# EAGLE schematic CHIP_POCKET_C (EAGLE 7.6.0)

## Sheet 1 of 2
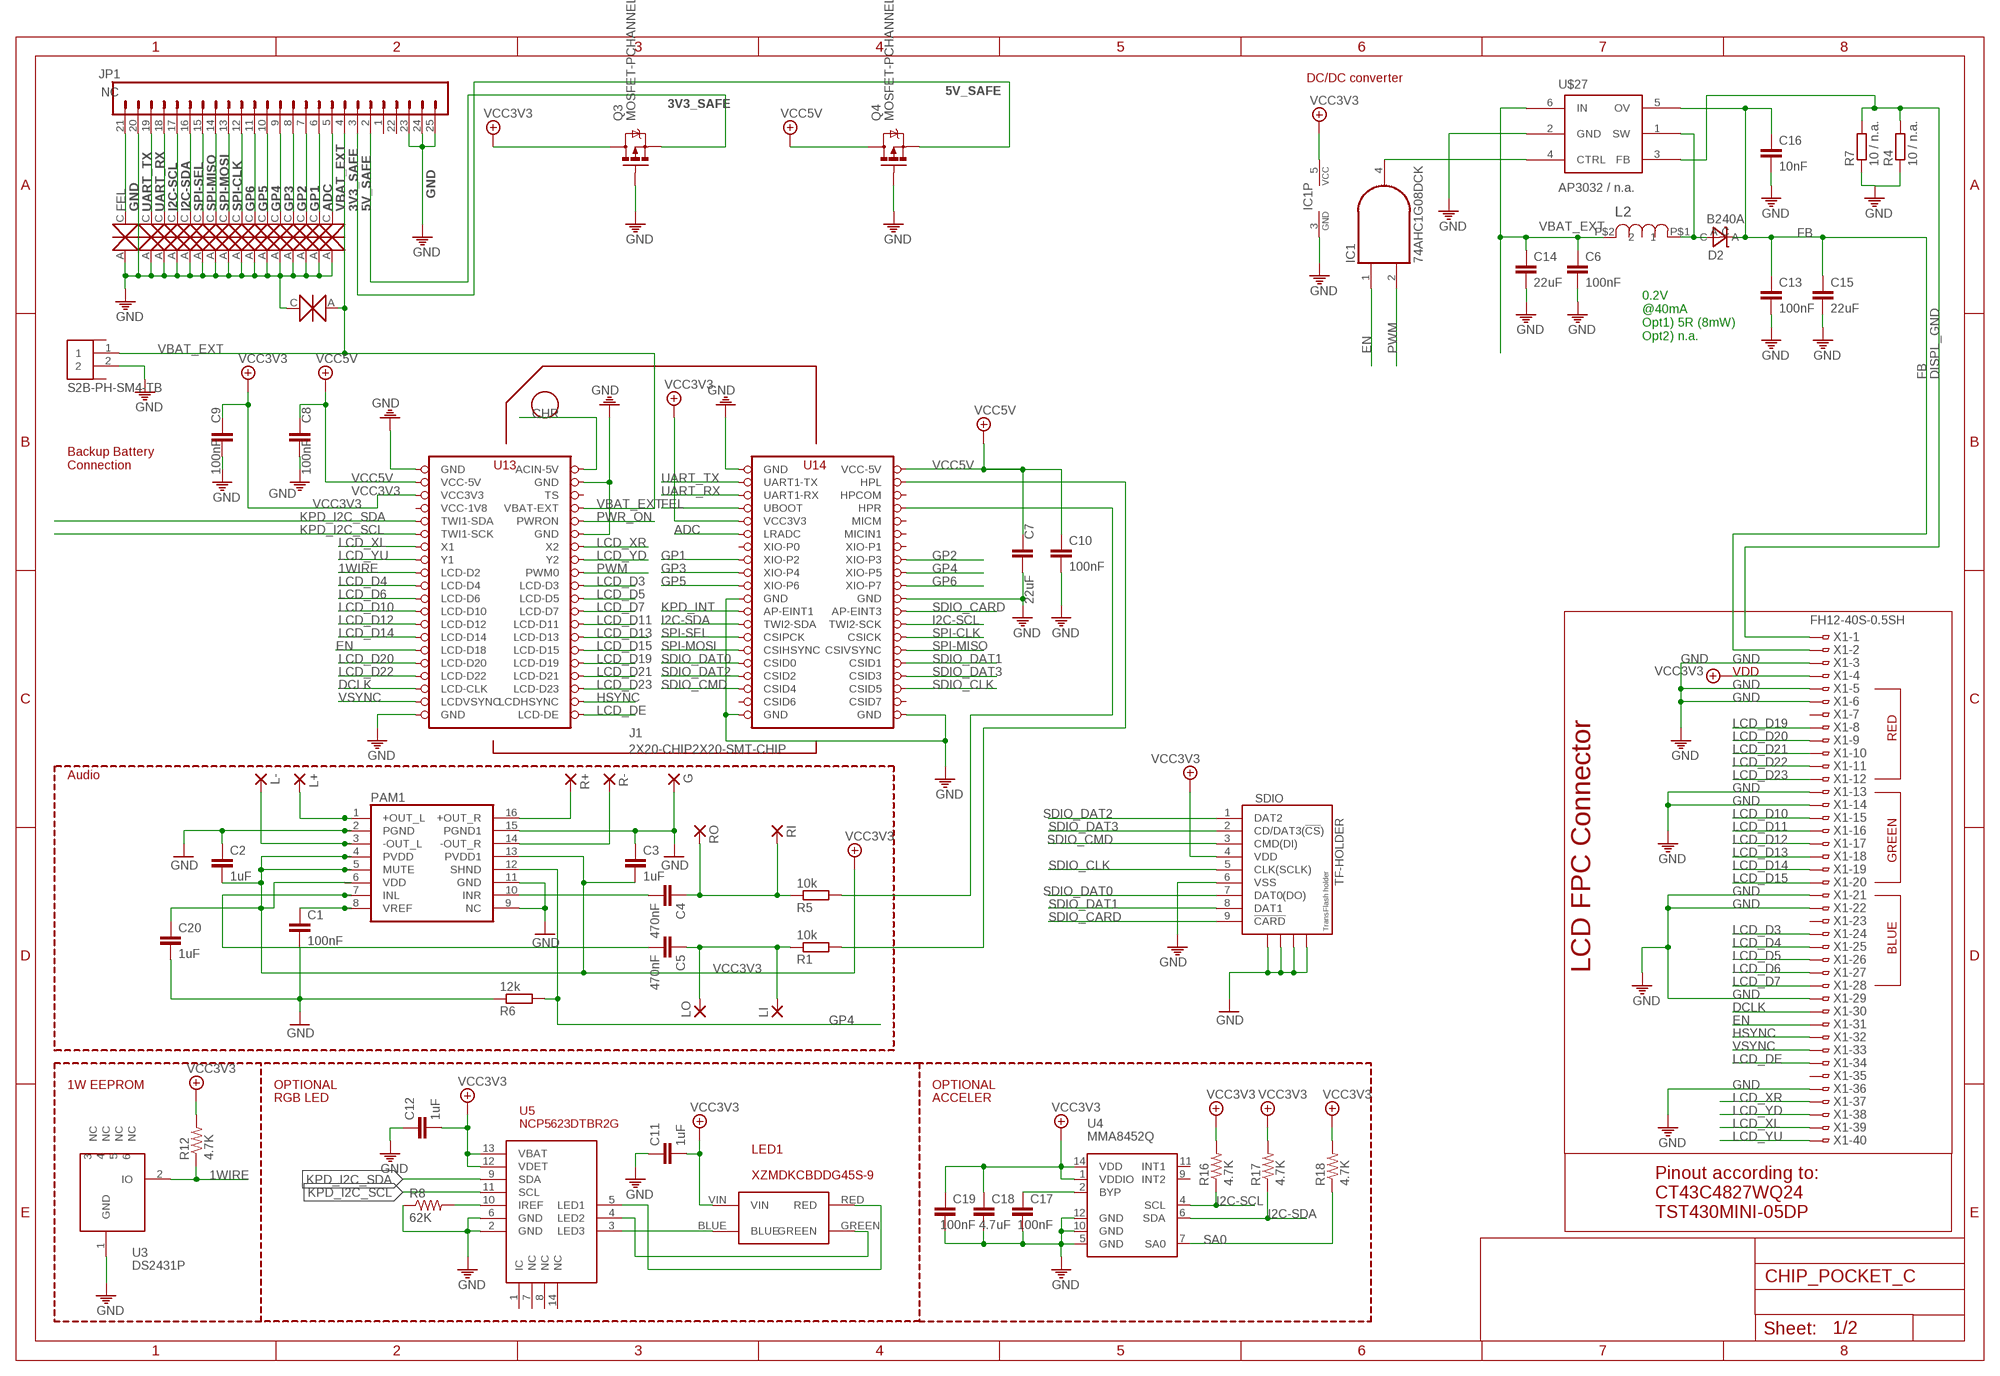
[diagram p0: schematic, sheet 1, part 1 of 2]
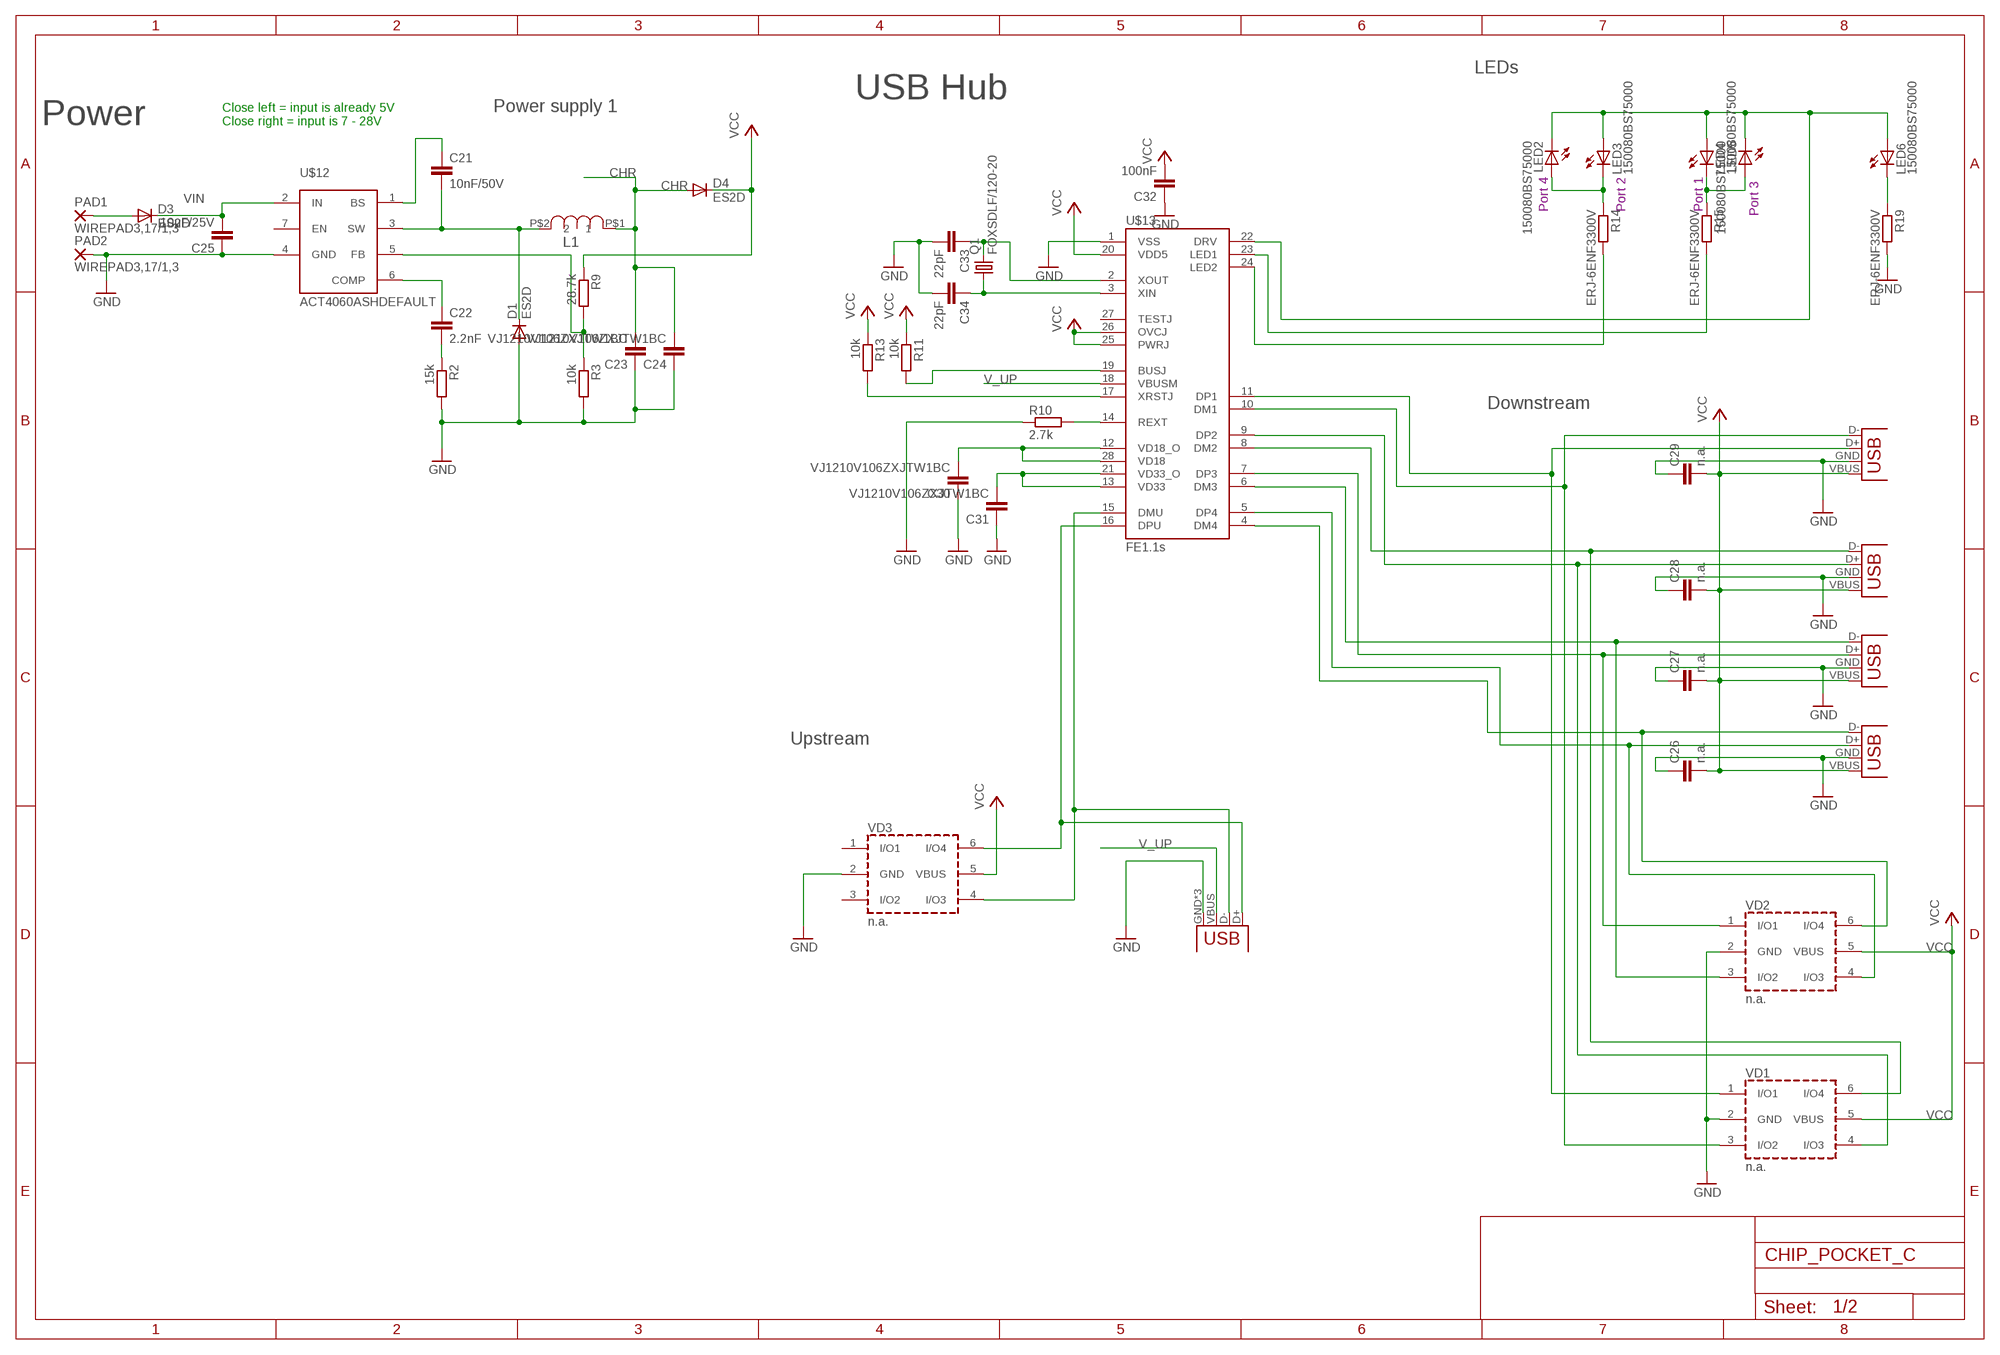
[diagram p1: schematic, sheet 1, part 2 of 2]

### Parts
C1  100nF  C-EUC0805  [C0805]
C2  1uF  C-EUC0805  [C0805]
C3  1uF  C-EUC0805  [C0805]
C4  470nF  C-EUC0805  [C0805]
C5  470nF  C-EUC0805  [C0805]
C6  100nF  C-EUC0805  [C0805]
C7  22uF  C1206_22UF_50V_10%  [C1206]
C8  100nF  C0402_100NF_50V_10%  [C0402]
C9  100nF  C0402_100NF_50V_10%  [C0402]
C10  100nF  C0402_100NF_50V_10%  [C0402]
C11  1uF  C0402_1UF_50V_10%  [C0402]
C12  1uF  C0402_1UF_50V_10%  [C0402]
C13  100nF  C-EUC0805  [C0805]
C14  22uF  C-EUC1206  [C1206]
C15  22uF  C-EUC1206  [C1206]
C16  10nF  C-EUC0805  [C0805]
C17  100nF  C0402_100NF_50V_10%  [C0402]
C18  4.7uF  C0402_100NF_50V_10%  [C0402]
C19  100nF  C0402_100NF_50V_10%  [C0402]
C20  1uF  C-EUC0805  [C0805]
C21  10nF/50V  C-EUC0805  [C0805]
C22  2.2nF  C-EUC0805  [C0805]
C23  VJ1210V106ZXJTW1BC  C-EUC1210  [C1210]
C24  VJ1210V106ZXJTW1BC  C-EUC1210  [C1210]
C25  10uF/25V  C-EUC1210  [C1210]
C26  n.a.  C-EUC1210  [C1210]
C27  n.a.  C-EUC1210  [C1210]
C28  n.a.  C-EUC1210  [C1210]
C29  n.a.  C-EUC1210  [C1210]
C30  VJ1210V106ZXJTW1BC  C-EUC1210  [C1210]
C31  VJ1210V106ZXJTW1BC  C-EUC1210  [C1210]
C32  100nF  C-EUC0805  [C0805]
C33  22pF  C-EUC0805  [C0805]
C34  22pF  C-EUC0805  [C0805]
D1  ES2D  [SMB]
D2  B240A  DIODE_SCHTKY_B240  [DO-214AC]
D3  ES2D  [SMB]
D4  ES2D  [SMB]
DATA_USB  USBUSB-MICROB-SMT-DIP  [USB-MICROB-SMT-DIP]
ESD1  ESD5Z2.5T1G  [SOD523]
ESD2  ESD5Z2.5T1G  [SOD523]
ESD3  ESD5Z2.5T1G  [SOD523]
ESD4  ESD5Z2.5T1G  [SOD523]
ESD5  ESD5Z2.5T1G  [SOD523]
ESD6  ESD5Z2.5T1G  [SOD523]
ESD7  ESD5Z2.5T1G  [SOD523]
ESD8  ESD5Z2.5T1G  [SOD523]
ESD9  ESD5Z2.5T1G  [SOD523]
ESD10  ESD5Z2.5T1G  [SOD523]
ESD11  ESD5Z2.5T1G  [SOD523]
ESD12  ESD5Z2.5T1G  [SOD523]
ESD13  ESD5Z2.5T1G  [SOD523]
ESD14  ESD5Z2.5T1G  [SOD523]
ESD15  ESD5Z2.5T1G  [SOD523]
ESD16  ESD5Z2.5T1G  [SOD523]
ESD17  ESD5Z2.5T1G  [SOD523]
G  1,6/0,8  [1,6/0,8]
IC1  74AHC1G08DCK  [SC70-5]
J1  2X20-CHIP2X20-SMT-CHIP  [2XAWHW40_G_SMD_R]
J3  S2B-PH-SM4-TB  [S2B-PH-SM4-TB]
JP1  NC  M20LOCK_LONGPADS  [1X20_LOCK_LONGPADS]
L1  SRN6045-100M  [SRN6045]
L2  SRN6045-100M  [SRN6045]
L+  1,6/0,8  [1,6/0,8]
L-  1,6/0,8  [1,6/0,8]
LED1  XZMDKCBDDG45S-9  [XZMDKCBDDG45S-9]
LED2  150080BS75000  LEDCHIP-LED0805  [CHIP-LED0805]
LED3  150080BS75000  LEDCHIP-LED0805  [CHIP-LED0805]
LED4  150080BS75000  LEDCHIP-LED0805  [CHIP-LED0805]
LED5  150080BS75000  LEDCHIP-LED0805  [CHIP-LED0805]
LED6  150080BS75000  LEDCHIP-LED0805  [CHIP-LED0805]
LI  1,6/0,8  [1,6/0,8]
LO  1,6/0,8  [1,6/0,8]
PAD1  WIREPAD3,17/1,3  [3,17/1,3]
PAD2  WIREPAD3,17/1,3  [3,17/1,3]
PAM1  PAM8403  [SOP-16]
Q1  FOXSDLF/120-20  CRYSTALSM49  [SM49]
Q3  MOSFET-PCHANNEL  [SOT23-3]
Q4  MOSFET-PCHANNEL  [SOT23-3]
R1  10k  R-EU_R0805  [R0805]
R2  15k  R-EU_R0805  [R0805]
R3  10k  R-EU_R0805  [R0805]
R4  10 / n.a.  R-EU_M0805  [M0805]
R5  10k  R-EU_R0805  [R0805]
R6  12k  R-EU_R0805  [R0805]
R7  10 / n.a.  R-EU_M0805  [M0805]
R8  62K  R0402_62K_5%  [R0402]
R9  28.7k  R-EU_R0805  [R0805]
R10  2.7k  R-EU_R0805  [R0805]
R11  10k  R-EU_R0805  [R0805]
R12  4.7K  R0402_4K7_5%  [R0402]
R13  10k  R-EU_R0805  [R0805]
R14  ERJ-6ENF3300V  R-EU_R0805  [R0805]
R15  ERJ-6ENF3300V  R-EU_R0805  [R0805]
R16  4.7K  R0402_4K7_5%  [R0402]
R17  4.7K  R0402_4K7_5%  [R0402]
R18  4.7K  R0402_4K7_5%  [R0402]
R19  ERJ-6ENF3300V  R-EU_R0805  [R0805]
R+  1,6/0,8  [1,6/0,8]
R-  1,6/0,8  [1,6/0,8]
RI  1,6/0,8  [1,6/0,8]
RO  1,6/0,8  [1,6/0,8]
SDIO  TF-HOLDER  [TF-PULL]
U3  DS2431P  [TSOC6]
U4  MMA8452Q  [QFN-16_0.5MM]
U5  NCP5623DTBR2G  [TSSOP14]
U$12  ACT4060ASHDEFAULT  [SOP-8]
U$13  FE1.1S  [FE1.1S_SSOP-28]
U$27  AP3032 / n.a.  AP3032  [SOT23-6]
VD1  n.a.  USBLC6-4SC6  [SOT-23-6L]
VD2  n.a.  USBLC6-4SC6  [SOT-23-6L]
VD3  n.a.  USBLC6-4SC6  [SOT-23-6L]
X1  FH12-40S-0.5SH  [FH12-40S-0.5SH]
X2  USB-A-HU  [USB-A-HU]
X3  USB-A-HU  [USB-A-HU]
X4  USB-A-HU  [USB-A-HU]
X5  USB-A-HU  [USB-A-HU]

### Nets
1WIRE: J1.LCD-D2 R12.1 U3.2(IO)
3V3_SAFE: JP1.2 Q3.2(S)
5V_SAFE: JP1.3 Q4.2(S)
ADC: ESD16.C J1.LRADC JP1.5
AUDIO_L: J1.HPL R1.2
AUDIO_R: J1.HPR R5.2
CHR: C23.2 C24.2 D4.A J1.CHG-IN(ACIN-5V) L1.P$1
DCLK: J1.LCD-CLK X1.30
DISPL_GND: R4.2 R7.2 U$27.3(FB) X1.1
DM1: U$13.10(DM1) VD1.3(I/O2) X5.D-(D+)
DM2: U$13.8(DM2) VD1.6(I/O4) X4.D-(D+)
DM3: U$13.6(DM3) VD2.3(I/O2) X3.D-(D+)
DM4: U$13.4(DM4) VD2.6(I/O4) X2.D-(D+)
DMU: DATA_USB.D- U$13.15(DMU) VD3.4(I/O3)
DP1: U$13.11(DP1) VD1.1(I/O1) X5.D+(D-)
DP2: U$13.9(DP2) VD1.4(I/O3) X4.D+(D-)
DP3: U$13.7(DP3) VD2.1(I/O1) X3.D+(D-)
DP4: U$13.5(DP4) VD2.4(I/O3) X2.D+(D-)
DPU: DATA_USB.D+ U$13.16(DPU) VD3.6(I/O4)
EN: IC1.1(I0) J1.LCD-D18 X1.31
FB: C13.1 C15.1 C16.1 D2.C U$27.5(OV) X1.2
FEL: ESD1.C J1.FEL(UBOOT) JP1.21
GND: C1.2 C2.1 C3.1 C6.2 C7.2 C8.2 C9.2 C10.2 C11.1 C12.1 C13.2 C14.2 C15.2 C16.2 C17.2 C18.2 C19.2 C20.2 C23.1 C24.1 C25.1 C26.1 C27.1 C28.1 C29.1 C30.1 C31.1 C32.1 C33.2 C34.2 D1.A DATA_USB.GND DATA_USB.MT1(GND) DATA_USB.MT2(GND) ESD1.A ESD2.A ESD3.A ESD4.A ESD5.A ESD6.A ESD7.A ESD8.A ESD9.A ESD10.A ESD11.A ESD12.A ESD13.A ESD14.A ESD15.A ESD16.A ESD17.C G.1(P) IC1.3(GND) J1.GND@1(GND) J1.GND@2(GND) J1.GND@3(GND) J1.GND@4(GND) J1.GND@5(GND) J1.GND@6(GND) J1.GND@7(GND) J1.GND@8(GND) J1.GND@10(GND) J3.2 JP1.20 JP1.23 JP1.24 JP1.25 PAD2.1(P) PAM1.2(PGND) PAM1.9(NC) PAM1.11(GND) PAM1.15(PGND1) Q3.1(G) Q4.1(G) R3.2 R4.1 R6.1 R7.1 R8.1 R10.1 R19.2 SDIO.6(VSS) SDIO.S1 SDIO.S2 SDIO.S3 SDIO.S4 U3.1(GND) U4.5(GND) U4.10(GND) U4.12(GND) U5.2(GND) U5.6(GND) U$12.4(GND) U$13.1(VSS) U$27.2(GND) VD1.2(GND) VD2.2(GND) VD3.2(GND) X1.3 X1.5 X1.6 X1.13 X1.14 X1.21 X1.22 X1.29 X1.36 X2.GND(VBUS) X3.GND(VBUS) X4.GND(VBUS) X5.GND(VBUS)
GP1: ESD15.C J1.XIO-P2 JP1.6
GP2: ESD14.C J1.XIO-P3 JP1.7
GP3: ESD13.C J1.XIO-P4 JP1.8
GP4: ESD12.C J1.XIO-P5 JP1.9 PAM1.12(SHND) R6.2
GP5: ESD11.C J1.XIO-P6 JP1.10
GP6: ESD10.C J1.XIO-P7 JP1.11
HSYNC: J1.LCD-HSYNC(LCDHSYNC) X1.32
I2C-SCL: ESD4.C J1.TWI2-SCK JP1.17 R16.1 U4.4(SCL)
I2C-SDA: ESD5.C J1.TWI2-SDA JP1.16 R17.1 U4.6(SDA)
INL: C5.2 PAM1.7(INL)
INR: C4.2 PAM1.10(INR)
KPD_I2C_SCL: J1.TWI1-SCK U5.11(SCL)
KPD_I2C_SDA: J1.TWI1-SDA U5.9(SDA)
KPD_INT: J1.AP-EINT1
L+OUT: L+.1(P) PAM1.1(+OUT_L)
L-OUT: L-.1(P) PAM1.3(-OUT_L)
LCD_D3: J1.LCD-D3 X1.24
LCD_D4: J1.LCD-D4 X1.25
LCD_D5: J1.LCD-D5 X1.26
LCD_D6: J1.LCD-D6 X1.27
LCD_D7: J1.LCD-D7 X1.28
LCD_D10: J1.LCD-D10 X1.15
LCD_D11: J1.LCD-D11 X1.16
LCD_D12: J1.LCD-D12 X1.17
LCD_D13: J1.LCD-D13 X1.18
LCD_D14: J1.LCD-D14 X1.19
LCD_D15: J1.LCD-D15 X1.20
LCD_D19: J1.LCD-D19 X1.8
LCD_D20: J1.LCD-D20 X1.9
LCD_D21: J1.LCD-D21 X1.10
LCD_D22: J1.LCD-D22 X1.11
LCD_D23: J1.LCD-D23 X1.12
LCD_DE: J1.LCD-DE X1.34
LCD_XL: J1.X1 X1.39
LCD_XR: J1.X2 X1.37
LCD_YD: J1.Y2 X1.38
LCD_YU: J1.Y1 X1.40
N$48: C17.1 U4.2(BYP)
N$50: LED1.GREEN U5.4(LED2)
N$51: LED1.RED U5.5(LED1)
N$53: R8.2 U5.10(IREF)
N$60: IC1.4(O) U$27.4(CTRL)
N$61: C1.1 PAM1.8(VREF)
N$62: C5.1 LI.1(P) LO.1(P) R1.1
N$63: C4.1 R5.1 RI.1(P) RO.1(P)
N$64: D3.A PAD1.1(P)
N$65: C21.2 D1.C L1.P$2 U$12.3(SW)
N$66: C21.1 U$12.1(BS)
N$67: C22.2 R2.1
N$68: C22.1 U$12.6(COMP)
N$69: R3.1 R9.2 U$12.5(FB)
N$70: C31.2 U$13.13(VD33) U$13.21(VD33_O)
N$71: C30.2 U$13.12(VD18_O) U$13.28(VD18)
N$72: R10.2 U$13.14(REXT)
N$73: R13.2 U$13.17(XRSTJ)
N$74: R11.2 U$13.19(BUSJ)
N$75: C33.1 Q1.2 U$13.2(XOUT)
N$76: C34.1 Q1.1 U$13.3(XIN)
N$77: LED6.C R19.1
N$78: LED4.C LED5.A R15.1
N$79: LED2.A LED3.C R14.1
N$80: LED2.C LED3.A LED4.A LED5.C LED6.A U$13.22(DRV)
N$81: R14.2 U$13.24(LED2)
N$82: R15.2 U$13.23(LED1)
N$555: LED1.BLUE U5.3(LED3)
PWM: IC1.2(I1) J1.PWM0
PWR_ON: J1.PWRON
R+OUT: PAM1.16(+OUT_R) R+.1(P)
R-OUT: PAM1.14(-OUT_R) R-.1(P)
SA0: R18.1 U4.7(SA0)
SDIO_CARD: J1.AP-EINT3 SDIO.9(!CARD)
SDIO_CLK: J1.CSID5 SDIO.5(CLK(SCLK))
SDIO_CMD: J1.CISD4(CSID4) SDIO.3(CMD(DI))
SDIO_DAT0: J1.CSID0 SDIO.7(DAT0(DO))
SDIO_DAT1: J1.CSID1 SDIO.8(DAT1)
SDIO_DAT2: J1.CSID2 SDIO.1(DAT2)
SDIO_DAT3: J1.CSID3 SDIO.2(CD/DAT3(!CS!))
SPI-CLK: ESD9.C J1.CSICK JP1.12
SPI-MISO: ESD7.C J1.CSIVSYNC JP1.14
SPI-MOSI: ESD8.C J1.CSIHYSYNC(CSIHSYNC) JP1.13
SPI-SEL: ESD6.C J1.CSPICK(CSIPCK) JP1.15
UART_RX: ESD3.C J1.UART1-RX JP1.18
UART_TX: ESD2.C J1.UART1-TX JP1.19
V_UP: DATA_USB.VBUS U$13.18(VBUSM)
VBAT_EXT: C6.1 C14.1 ESD17.A J1.BAT(VBAT-EXT) J3.1 JP1.4 L2.P$2 U$27.6(IN)
VCC: C26.2 C27.2 C28.2 C29.2 C32.2 D4.C R9.1 R11.1 R13.1 U$13.20(VDD5) U$13.25(PWRJ) U$13.26(OVCJ) VD1.5(VBUS) VD2.5(VBUS) VD3.5(VBUS) X2.VBUS(GND) X3.VBUS(GND) X4.VBUS(GND) X5.VBUS(GND)
VCC3V3: C2.2 C3.2 C9.1 C11.2 C12.2 C18.1 C19.1 C20.1 IC1.5(VCC) J1.VCC3V3@1(VCC3V3) J1.VCC3V3@2(VCC3V3) LED1.VIN PAM1.4(PVDD) PAM1.5(MUTE) PAM1.6(VDD) PAM1.13(PVDD1) Q3.3(D) R12.2 R16.2 R17.2 R18.2 SDIO.4(VDD) U4.1(VDDIO) U4.14(VDD) U5.12(VDET) U5.13(VBAT) X1.4
VCC5V: C7.1 C8.1 C10.1 J1.VCC-5V@1(VCC-5V) J1.VCC-5V@2(VCC-5V) Q4.3(D)
VIN: C25.2 D3.C U$12.2(IN)
VREG_OUTPUT1: D2.A L2.P$1 U$27.1(SW)
VSYNC: J1.LCD-VSYNC(LCDVSYNC) X1.33
Unconnected: J1.CSID6 J1.CSID7 J1.HPCOM J1.MICIN1 J1.MICM J1.TS J1.XIO-P0 J1.XIO-P1 J3.MNT1 J3.MNT2 JP1.1 JP1.22 R2.2 U3.3(NC) U3.4(NC) U3.5(NC) U3.6(NC) U4.9(INT2) U4.11(INT1) U5.1(IC) U5.7(NC) U5.8(NC) U5.14(NC) U$12.7(EN) U$13.27(TESTJ) VD3.1(I/O1) VD3.3(I/O2) X1.7 X1.23 X1.35

### Notes on the sheet
- DC/DC converter
- LEDs
- USB Hub
- Power supply 1
- Power
- Close left = input is already 5V
  Close right = input is 7 - 28V
- Port 4 | Port 2 | Port 1
- Port 3
- 0.2V
  @40mA
  Opt1) 5R (8mW)
  Opt2) n.a.
- <- cut here
- Downstream
- Backup Battery
  Connection
- VDD
- RED
- Upstream
- Audio
- GREEN
- cut here
- BLUE
- cut here
- LCD FPC Connector
- 1W EEPROM | OPTIONAL | OPTIONAL
- <- cut here
- RGB LED | ACCELER
- Pinout according to:
  CT43C4827WQ24
  TST430MINI-05DP

## Sheet 2 of 2

## Power pins joined to a net without a drawn wire
VCC-1V8: J1.VCC1V8(VCC-1V8)

## Library data of the parts
C1-C6 C13-C16 C20-C34 = rcl:C-EU: CAPACITOR, European symbol
C7 = Keyboard v0_5:C1206_22UF_50V_10%; DESCRIPTION: CAP ceramic smd 20% 35V 1206; FOOTPRINT: C1206; LINK: http://www.digikey.com/product-detail/en/C3216X5R1V226M160AC/445-8045-1-ND/2792165; MFG: DIGIKEY; MFG_PN: 445-8045-1-ND; PART_TYPE: C1206; PRICE: 0.01; TOLLERANCE: 20%; VENDOR: TDK; VENDOR_PART_NUMBER: C3216X5R1V226M160AC
C8-C10 = Keyboard v0_5:C0402_100NF_50V_10%; DESCRIPTION: CAP CER SMD 100nF 25V 10% 0402; FOOTPRINT: C0402; LINK: http://www.digikey.co.il/product-detail/en/C1005X5R1E104K050BC/445-4964-1-ND/2093578; MFG: DIGIIKEY; MFG_PN: 445-4964-1-ND; PART_TYPE: C0402; PRICE: 0.01; TOLLERANCE: 10%; VENDOR: TDK; VENDOR_PART_NUMBER: C1005X5R1E104K050BC
C11 C12 = Keyboard_v0_7:C0402_1UF_50V_10%; DESCRIPTION: CAP CER SMD 100nF 25V 10% 0402; FOOTPRINT: C0402; LINK: http://www.digikey.co.il/product-detail/en/C1005X5R1E104K050BC/445-4964-1-ND/2093578; MFG: DIGIIKEY; MFG_PN: 445-4964-1-ND; PART_TYPE: C0402; PRICE: 0.01; TOLLERANCE: 10%; VALUE: 100nF; VENDOR: TDK; VENDOR_PART_NUMBER: C1005X5R1E104K050BC
C17 C19 = PocketCHIP-Components-v0.71:C0402_100NF_50V_10%; DESCRIPTION: CAP CER SMD 100nF 25V 10% 0402; FOOTPRINT: C0402; LINK: http://www.digikey.co.il/product-detail/en/C1005X5R1E104K050BC/445-4964-1-ND/2093578; MFG: DIGIIKEY; MFG_PN: 445-4964-1-ND; PART_TYPE: C0402; PRICE: 0.01; TOLLERANCE: 10%; VENDOR: TDK; VENDOR_PART_NUMBER: C1005X5R1E104K050BC
C18 = PocketCHIP-Components-v0.71:C0402_100NF_50V_10%; DESCRIPTION: CAP CER SMD 100nF 25V 10% 0402; FOOTPRINT: C0402; LINK: http://www.digikey.co.il/product-detail/en/C1005X5R1E104K050BC/445-4964-1-ND/2093578; MFG: DIGIIKEY; MFG_PN: 445-4964-1-ND; PART_TYPE: C0402; PRICE: 0.01; TOLLERANCE: 10%; VALUE: 100nF; VENDOR: TDK; VENDOR_PART_NUMBER: C1005X5R1E104K050BC
D1 D3 D4 = diode:ES2D: DIODE super fast rectifier, 2 A
D2 = Keyboard v0_5:DIODE_SCHTKY_B240; DESCRIPTION: DIODE SMD General Purpose 400V 1A 1.4W RoHS DO-214AC; FOOTPRINT: DO-214AC; LINK: http://www.digikey.com/product-detail/en/B240A-13-F/B240A-FDICT-ND/717810; MFG: DIGIKEY; MFG_PN: B240A-FDICT-ND; PART_TYPE: DIODE; PRICE: 0.11; VENDOR: DIODES; VENDOR_PART_NUMBER: B240A-13-F
DATA_USB = Spark:USB
ESD1-ESD17 = PocketCHIP-Components-v0.71:ESD5Z2.5T1G
G L+ L- LI LO R+ R- RI RO = wirepad:1,6/0,8: THROUGH-HOLE PAD
IC1 = 74xx-little-us:74*1G08: 2-input AND gate
J1 = JKW_CHIP:2X20-CHIP: Chip header
J3 = Keyboard v0_5:S2B-PH-SM4-TB; DESCRIPTION: 2 pin con, 2MM RA, SMD; FOOTPRINT: S2B-PH-SM4-TB; LINK: http://www.digikey.com/product-detail/en/S2B-PH-SM4-TB(LF)(SN)/455-1749-1-ND/926846; MFG: DIGIKEY; MFG_PN: 455-1749-1-ND; PART_TYPE: CON; PRICE: 0.26; VENDOR: JST; VENDOR_PART_NUMBER: S2B-PH-SM4-TB(LF)(SN)
JP1 = PocketCHIP-Components-v0.71:M20: 1x20 .1" header This is just like the LOCK variant in that the holes are staggared by 5 mil, but except for the last two holes. They are not altered from the "standard" footprint layout. This is used for a special purpose on the layout of our Graphic LCD Backpack. Make sure you want to use this device before selecting it for you project!
L1 L2 = Keyboard v0_5:SRN6045-100M; DESCRIPTION: power inductor 10uH 2.5A 58.6 mohm; FOOTPRINT: SRN6045; LINK: http://www.digikey.com/product-detail/en/SRN6045-100M/SRN6045-100MTR-ND/2756120; MFG: DIGIKEY; MFG_PN: SRN6045-100MTR-ND; PART_TYPE: IND; PRICE: 0.15; TOLLERANCE: ±20%; VENDOR: BOURNS; VENDOR_PART_NUMBER: SRN6045-100M
LED1 = PocketCHIP-Components-v0.71:XZMDKCBDDG45S-9
LED2-LED6 = led:LED: LED OSRAM: - CHIPLED LG R971, LG N971, LY N971, LG Q971, LY Q971, LO R971, LY R971 LH N974, LH R974 LS Q976, LO Q976, LY Q976 LO Q996 - Hyper CHIPLED LW Q18S LB Q993, LB Q99A, LB R99A - SideLED LS A670, LO A670, LY A670, LG A670, LP A670 LB A673, LV A673, LT A673, LW A673 LH A674 LY A675 LS A676, LA A676, LO A676, LY A676, LW A676 LS A679, LY A679, LG A679 - Hyper Micro SIDELED® LS Y876, LA Y876, LO Y876, LY Y876 LT Y87S - SmartLED LW L88C, LW L88S LB L89C, LB L89S, LG L890 LS L89K, LO L89K, LY L89K LS L896, LA L896, LO L896, LY L896 - TOPLED LS T670, LO T670, LY T670, LG T670, LP T670 LSG T670, LSP T670, LSY T670, LOP T670, LYG T670 LG T671, LOG T671, LSG T671 LB T673, LV T673, LT T673, LW T673 LH T674 LS T676, LA T676, LO T676, LY T676, LB T676, LH T676, LSB T676, LW T676 LB T67C, LV T67C, LT T67C, LS T67K, LO T67K, LY T67K, LW E67C LS E67B, LA E67B, LO E67B, LY E67B, LB E67C, LV E67C, LT E67C LW T67C LS T679, LY T679, LG T679 LS T770, LO T770, LY T770, LG T770, LP T770 LB T773, LV T773, LT T773, LW T773 LH T774 LS E675, LA E675, LY E675, LS T675 LS T776, LA T776, LO T776, LY T776, LB T776 LHGB T686 LT T68C, LB T68C - Hyper Mini TOPLED® LB M676 - Mini TOPLED Santana® LG M470 LS M47K, LO M47K, LY M47K Source: http://www.osram.convergy.de LUXEON: - LUMILED® LXK2-PW12-R00, LXK2-PW12-S00, LXK2-PW14-U00, LXK2-PW14-V00 LXK2-PM12-R00, LXK2-PM12-S00, LXK2-PM14-U00 LXK2-PE12-Q00, LXK2-PE12-R00, LXK2-PE12-S00, LXK2-PE14-T00, LXK2-PE14-U00 LXK2-PB12-K00, LXK2-PB12-L00, LXK2-PB12-M00, LXK2-PB14-N00, LXK2-PB14-P00, LXK2-PB14-Q00 LXK2-PR12-L00, LXK2-PR12-M00, LXK2-PR14-Q00, LXK2-PR14-R00 LXK2-PD12-Q00, LXK2-PD12-R00, LXK2-PD12-S00 LXK2-PH12-R00, LXK2-PH12-S00 LXK2-PL12-P00, LXK2-PL12-Q00, LXK2-PL12-R00 Source: www.luxeon.com KINGBRIGHT: KA-3528ASYC Source: www.kingbright.com
PAD1 PAD2 = wirepad:WIREPAD: Wire PAD connect wire on PCB
PAM1 = JKW_CHIP:PAM8403: Dual channel audio amplifier IC - PAM8403
Q1 = adafruit:CRYSTAL: CRYSTAL; OC_FARNELL: unknown; OC_NEWARK: unknown
Q3 Q4 = PocketCHIP-Components-v0.72:MOSFET-PCHANNEL: Generic PMOSFET; PROD_ID: TRANS-08285
R1-R7 R9-R11 R13-R15 R19 = rcl:R-EU_: RESISTOR, European symbol
R8 = Keyboard_v0_7:R0402_62K_5%; DESCRIPTION: RES SMD 1K Ohm 1/16W 5% 0402; FOOTPRINT: R0402; LINK: http://search.digikey.com/us/en/products/ERJ-2GEJ102X/P1.0KJCT-ND/146897; MFG: DIGIKEY; MFG_PN: P1.0KJCT-ND; PART_TYPE: R0402; PRICE: 0.01; TOLLERANCE: 5%; VALUE: 1K; VENDOR: PANASONIC; VENDOR_PART_NUMBER: ERJ-2GEJ102X
R12 = Keyboard v0_5:R0402_4K7_5%; DESCRIPTION: RES SMD 4.7K Ohm 1/16W 5% oHS 0402; FOOTPRINT: R0402; LINK: http://search.digikey.com/us/en/products/ERJ-2GEJ472X/P4.7KJCT-ND/147025; MFG: DIGIKEY; MFG_PN: P4.7KJCT-ND; PART_TYPE: R0402; PRICE: 0.01; TOLLERANCE: 5%; VENDOR: PANASONIC; VENDOR_PART_NUMBER: ERJ-2GEJ472X
R16-R18 = PocketCHIP-Components-v0.71:R0402_4K7_5%; DESCRIPTION: RES SMD 4.7K Ohm 1/16W 5% oHS 0402; FOOTPRINT: R0402; LINK: http://search.digikey.com/us/en/products/ERJ-2GEJ472X/P4.7KJCT-ND/147025; MFG: DIGIKEY; MFG_PN: P4.7KJCT-ND; PART_TYPE: R0402; PRICE: 0.01; TOLLERANCE: 5%; VENDOR: PANASONIC; VENDOR_PART_NUMBER: ERJ-2GEJ472X
SDIO = JKW_CHIP:TF-HOLDER: TF / Micro SD socket is PUSH-PUSH type, the card can be pushed into and auto locked and pushed out by simply press the card. Surface Mounting type.
U3 = Keyboard v0_5:DS2431: 1024-Bit EEPROM This chip provides a 4x256 Bit EEPROM, which can be programmed@5V. Write protection and OTP emulation are available, too. Author: Jan Kandziora <jjj@gmx.de>; DESCRIPTION: IC, 1024-Bit, 1-Wire EEPROM, TSOC6; FOOTPRINT: TSOC6; LINK: http://www.digikey.com/product-detail/en/DS2431P%2BT%26R/DS2431P%2BT%26RCT-ND/3647900; MFG: DIGIKEY; MFG_PN: DS2431P+T&RCT-ND; PART_TYPE: IC; PRICE: 0.98; VENDOR: MAXIM; VENDOR_PART_NUMBER: DS2431P+T&R
U4 = PocketCHIP-Components-v0.71:MMA8452Q: MMA8452Q 3-Axis, 12/8-bit Digital Accelerometer Supply Voltage: 1.6-3.6V Range: +/- 2g, 4g, 8g Interface: I2C, 12-bit and 8-bit ODR: 1.56 Hz - 800 Hz Package: QFN-16 http://cache.freescale.com/files/sensors/doc/data_sheet/MMA8452Q.pdf
U5 = PocketCHIP-Components-v0.7:NCP5623DTBR2G
U$12 = JKW_CHIP:ACT4060ASH
U$13 = imcom:FE1.1S: A USB 2.0 hub IC. http://www.jfd-ic.com/Documents/FE1.1s%20Data%20Sheet%20%28Rev.%201.0%29.pdf
U$27 = JKW_CHIP:AP3032
VD1-VD3 = usblc6:USBLC6-4: Automotive very low capacitance ESD protection 4 line Features 4 data-line protection Protects V BUS Very low capacitance: 3 pF Very low leakage current: 10 nA SOT23-6L package RoHS compliant AEC Q101 qualified
X1 = Keyboard v0_5:FH12-40S-0.5S: 0.5mm Pitch Connectors For FPC/FFC Source: Data sheet <http://www.hirose.co.jp/cataloge_hp/e58605370.pdf>; DESCRIPTION: CON ffc smd, bottom contact 40pos, 0.50mm R/A; FOOTPRINT: FH12-40S-0.5SH; LINK: http://www.digikey.com/product-detail/en/FH12-40S-0.5SH(55)/HFJ140CT-ND/1110388; MFG: DIGIKEY; MFG_PN: HFJ140CT-ND; VENDOR: HIROSE; VENDOR_PART_NUMBER: FH12-40S-0.5SH(55)
X2-X5 = con-usb:USB: USB Connectors